# EasyEDA Pro project optoacopulador.eprj

# Schematic Schematic1
Board Name: Board1; Create Date: 2025-10-16; Page Name: P1; Project Name: optoacopulador; Schematic Name: Schematic1; Update Date: 2025-10-16; Company: EasyEDA.com; Page Size: A4; Version: V1.0
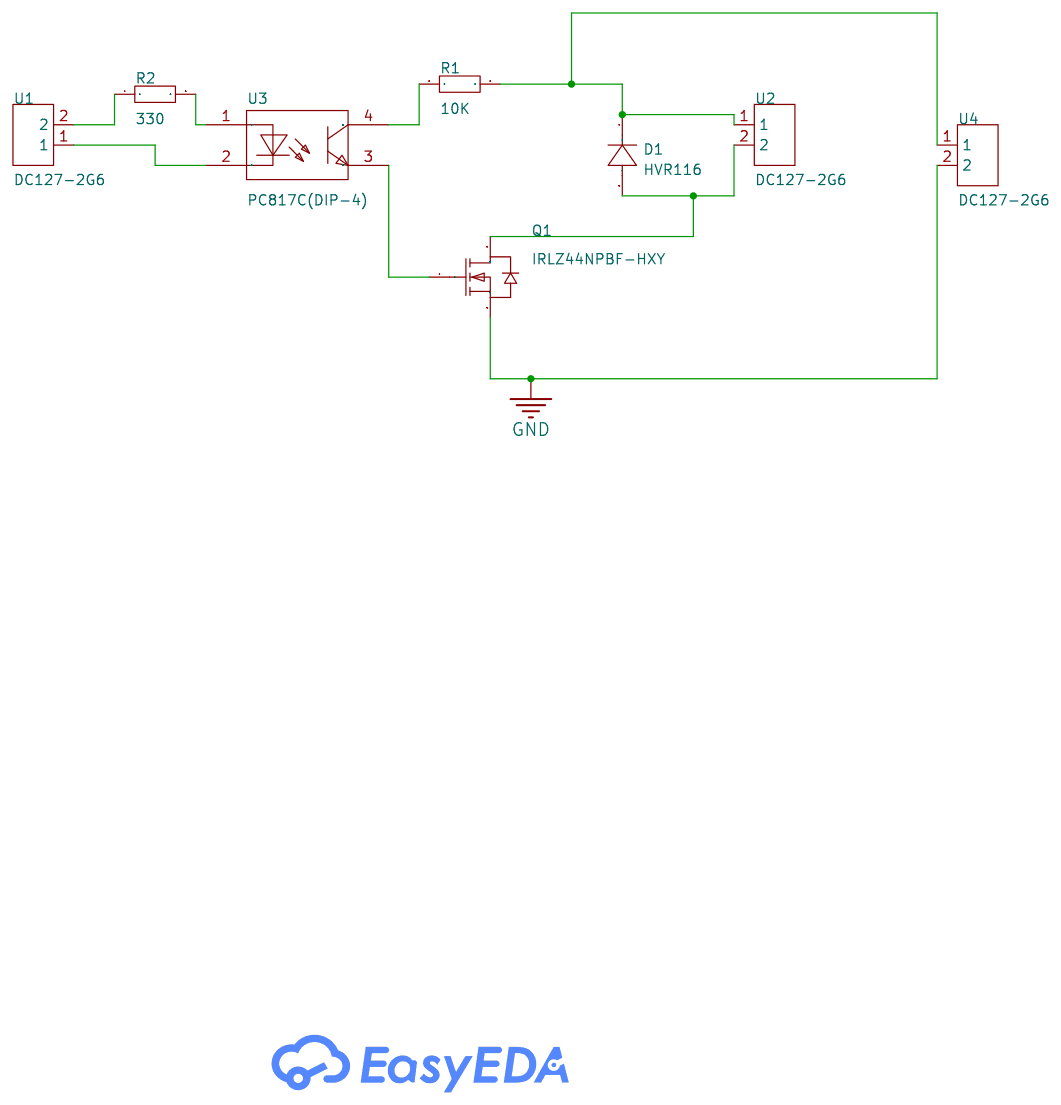
[diagram p0: schematic sheet]

## Parts
D1  HVR116  [DO-41_BD2.4-L4.7-P8.70-D0.8-RD]
Q1  IRLZ44NPBF-HXY  [TO-220-3_L9.9-W4.5-P2.54-L-1]
R1  10K  [R0603]
R2  330  [R0603]
U1  DC127-2G6  [CONN-TH_DC127-2G6]
U2  DC127-2G6  [CONN-TH_DC127-2G6]
U3  PC817C(DIP-4)  [DIP-4_L4.6-W6.5-P2.54-LS7.6-BL]
U4  DC127-2G6  [CONN-TH_DC127-2G6]

## Library data of the parts
D1 = HVR116: Supplier Part: C3015368; Manufacturer: EIC; Supplier Footprint: DO-41; JLCPCB Part Class: Extended Part; Datasheet: https://item.szlcsc.com/datasheet/HVR116/3527447.html; Supplier: LCSC; Voltage - Forward(Vf@If): 2.2V@1.0A; Voltage - DC Reverse(Vr): 1.6kV; Current - Rectified: 1A; Reverse Leakage Current (Ir): 5uA; Non-Repetitive Peak Forward Surge Current: 30A; Operating Junction Temperature Range: -40℃~+150℃
Q1 = IRLZ44NPBF-HXY: LCSC Part Name: 1个N沟道 耐压:60V 电流:60A; Supplier Part: C22367197; Manufacturer: HXY MOSFET(华轩阳电子); Supplier Footprint: TO-220; JLCPCB Part Class: Extended Part; Datasheet: https://item.szlcsc.com/datasheet/IRLZ44NPBF-HXY/23837831.html; Supplier: LCSC; Number: 1 N-Channel; Drain to Source Voltage: 60V; Current - Continuous Drain(Id): 60A; RDS(on): 20mΩ@10V; Pd - Power Dissipation: 120W; Gate Threshold Voltage (Vgs(th)): 4V@250uA; Gate Charge(Qg): 39nC@10V; Input Capacitance(Ciss): 4.05nF; Reverse Transfer Capacitance (Crss@Vds): 110pF; Operating Temperature: -55℃~+150℃; Type: N-Channel; Output Capacitance(Coss): 430pF
R1 R2 = Res_0603: Supplier Footprint: 0603
U1 U2 U4 = DC127-2G6: LCSC Part Name: DC127固定式接线端; Supplier Part: C42396432; Manufacturer: CONNFLY; Supplier Footprint: 插件,P=5mm; Datasheet: https://atta.szlcsc.com/upload/public/pdf/source/20241126/3E925E6246360DAF068B5D9563C59A5D.pdf; Supplier: LCSC
U3 = PC817C(DIP-4): Supplier Part: C50176486; Manufacturer: SEP(威旺); Supplier Footprint: DIP-4; JLCPCB Part Class: Extended Part; Datasheet: https://item.szlcsc.com/datasheet/PC817C(DIP-4)/52750376.html; Supplier: LCSC

## Nets
GND: Q1.3(S) U4.2
$1N224: D1.1(K) R1.1 U2.1 U4.1
$1N229: D1.2(A) Q1.2(D) U2.2
$1N308: U1.1 U3.2(CAT)
$1N407: R1.2 U3.4(COL)
$1N412: Q1.1(G) U3.3(EM)
$1N533: R2.2 U3.1(AN)
$1N537: R2.1 U1.2

# Board PCB1
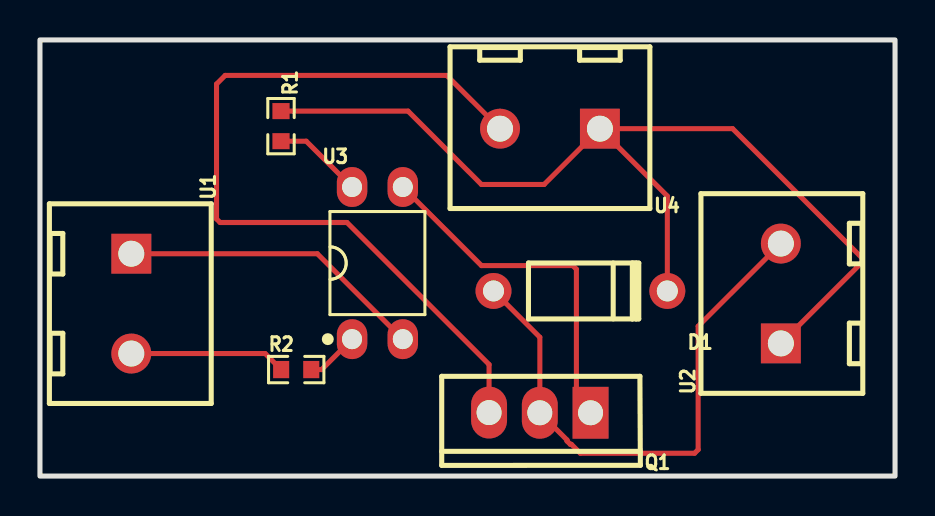
[diagram p1: board, top side]
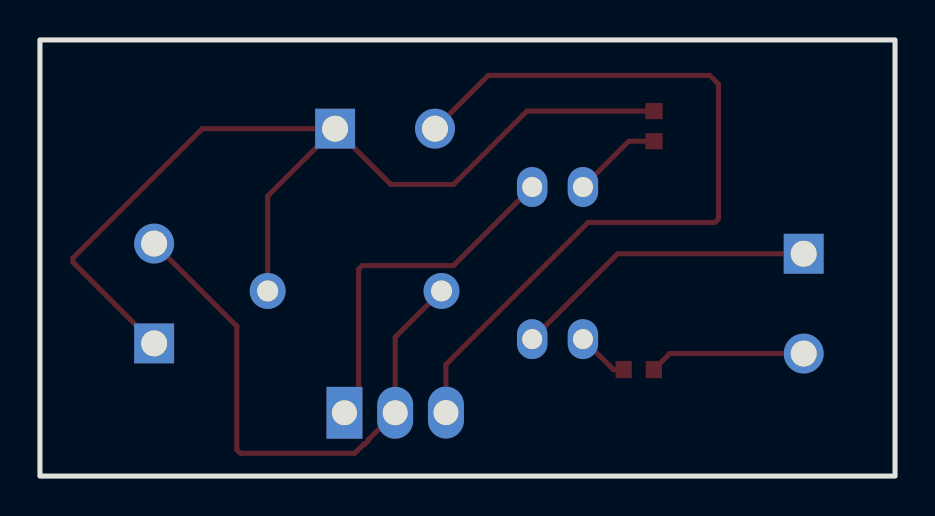
[diagram p2: board, bottom side, seen from below]

Outline 42.8 x 21.84 mm; copper layers: Top Layer, Bottom Layer. Coordinates in mm from the lower left corner of the outline.
Outline path: rectangle 0,21.84 42.8,0
Stack: Top Layer 0.035mm / Dielectric1 1.51mm FR4 er 4.5 / Bottom Layer 0.035mm

## Design rules (mm)
template: JLCPCB Capability(Two Layers Board)
spacing copperThickness1oz (default): track to track 0.102, other pairs 0.152 to 0.3
spacing copperThickness2oz: track to track 0.203, other pairs 0.152 to 0.3
track width copperThickness1oz (default): min 0.127, default 0.254, max 2.54
track width copperThickness2oz: min 0.203, default 0.254, max 2.54
differential pair differentialPair (default): width min 0.127, default 0.254, max 2.54; gap min 0.152, default 0.152
via viaSize (default): diameter min 0.5, default 0.61, max 10; hole min 0.3, default 0.305, max 6.3

## Placement (name value [footprint] x y rotation side)
D1  HVR116  [DO-41_BD2.4-L4.7-P8.70-D0.8-RD]  27.05 9.27 180 top
Q1  IRLZ44NPBF-HXY  [TO-220-3_L9.9-W4.5-P2.54-L-1]  25.02 3.17 180 top
R1  10K  [R0603]  12.06 17.53 270 top
R2  330  [R0603]  12.83 5.33 0 top
U1  DC127-2G6  [CONN-TH_DC127-2G6]  4.57 8.64 270 top
U2  DC127-2G6  [CONN-TH_DC127-2G6]  37.08 9.14 90 top
U3  PC817C(DIP-4)  [DIP-4_L4.6-W6.5-P2.54-LS7.6-BL]  16.89 10.67 0 top
U4  DC127-2G6  [CONN-TH_DC127-2G6]  25.53 17.4 180 top

## Footprints (pads in the part's own frame, mm; a bottom-side part is the same pattern mirrored in y, then rotated)
CONN-TH_DC127-2G6
  rect 2x2 hole 1.3: 1(-2.5,0)
  round 2 hole 1.3: 2(2.5,0)
DIP-4_L4.6-W6.5-P2.54-LS7.6-BL
  oval 1.524x2 hole 1: 1(-1.27,-3.81) 2(1.27,-3.81) 3(1.27,3.81) 4(-1.27,3.81)
DO-41_BD2.4-L4.7-P8.70-D0.8-RD
  round 1.8 hole 1.05: 1(-4.35,0) 2(4.35,0)
R0603
  rect 0.806x0.864 smd: 1(-0.753,0) 2(0.753,0)
TO-220-3_L9.9-W4.5-P2.54-L-1
  rect 1.8x2.6 hole 1.25: 1(-2.54,0.005)
  oval 1.8x2.6 hole 1.25: 2(0,0.005) 3(2.54,-0.005)

## Nets
As in the schematic.

## Routing (per net, layer and track width the routed paths; a pad name or vN(x,y) marks a point on that pad's centre or on a via; arc(x,y) is an arc through that point)
GND: length 41.3
  Top Layer w0.254: U4.2 20.36,20.07 9.27,20.07 8.84,19.63 8.84,12.88 9.02,12.7 15.37,12.7 22.48,5.59 Q1.3
$1N224: length 49.9
  Top Layer w0.254: R1.1 18.42,18.28 22.1,14.6 25.23,14.6 U4.1 ; U4.1 34.67,17.4 41.15,10.92 41.15,10.71 U2.1 ; U4.1 31.4,14.02 D1.1
$1N229: length 28
  Top Layer w0.254: D1.2 25.02,6.95 Q1.2 26.38,1.81 26.38,1.75 26.54,1.59 26.6,1.59 27.05,1.14 32.77,1.14 32.95,1.32 32.95,7.51 U2.2
$1N308: length 15.4
  Top Layer w0.254: U3.2 13.88,11.14 U1.1
$1N407: length 4.5
  Top Layer w0.254: R1.2 13.33,16.77 U3.4
$1N412: length 17.9
  Top Layer w0.254: U3.3 22.1,10.54 26.67,10.54 26.85,10.36 26.85,3.88 Q1.1
$1N533: length 2.7
  Top Layer w0.254: U3.1 14.1,5.33 R2.2
$1N537: length 7.8
  Top Layer w0.254: R2.1 11.27,6.14 U1.2
